# Altium schematic sheet BrauV2_USBSwitch.SchDoc
size 420 x 297 mm; PageSetup: Record=PageOptions|CenterHorizontal=True|CenterVertical=True|PrintScale=1.01|XCorrection=1.00|YCorrection=1.00|PrintKind=1|BorderSize=5000000|LeftOffset=0|BottomOffset=0|Orientation=2|PaperLength=1000|PaperWidth=1000|Scale=100|PaperSource=7|PrintQuality=-4|MediaType=1|DitherType=10|PaperKind=A3|PrintScaleMode=1; DocumentNumber: 15; SheetNumber: 15; SheetTotal: 22
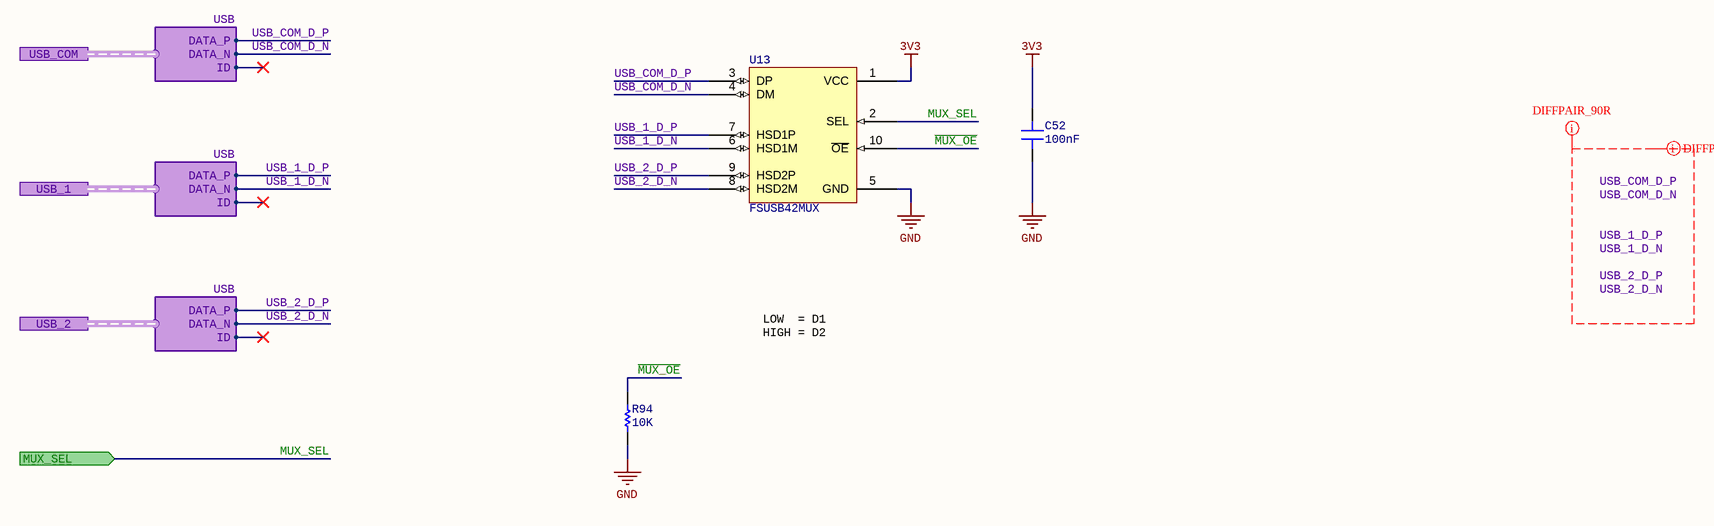
[diagram p0: BrauV2_USBSwitch.SchDoc]

## Parts
C52  Capacitance: 100nF  [SMD_CAP_0402(1005)_N]  (hidden comment: CC0402KRX5R6BB104)
R94  Resistance: 10K  [SMD_RES_0402(1005)_N]  (hidden comment: RC0402FR-0710KL)
U13  FSUSB42MUX  [MSOP-10]

## Ports
MUX_SEL (in), USB_1 (harness USB), USB_2 (harness USB), USB_COM (harness USB)

## Harnesses
USB: DATA_P, DATA_N, ID

## Nets
3V3: C52.2 U13.1(VCC)
GND: C52.1 R94.1 U13.5(GND)
~{MUX_OE}: R94.2 U13.10(~{OE})
MUX_SEL: U13.2(SEL) ; port MUX_SEL
USB_1_D_N: U13.6(HSD1M) ; port USB_1.DATA_N
USB_1_D_P: U13.7(HSD1P) ; port USB_1.DATA_P
USB_2_D_N: U13.8(HSD2M) ; port USB_2.DATA_N
USB_2_D_P: U13.9(HSD2P) ; port USB_2.DATA_P
USB_COM_D_N: U13.4(DM) ; port USB_COM.DATA_N
USB_COM_D_P: U13.3(DP) ; port USB_COM.DATA_P

## Layout directives
differential pair; differential pair class 90R_DIFF_PAIRS; net class 90R_PAIRS: USB_1_D_N, USB_1_D_P, USB_2_D_N, USB_2_D_P, USB_COM_D_N, USB_COM_D_P
mark named DIFFPAIR_90R: USB_1_D_N, USB_1_D_P, USB_2_D_N, USB_2_D_P, USB_COM_D_N, USB_COM_D_P

## Notes on the sheet
- LOW  = D1
  HIGH = D2
- Labels drawn without touching a wire or pin: USB_1_D_N, USB_1_D_P, USB_2_D_N, USB_2_D_P, USB_COM_D_N, USB_COM_D_P
- FILE NAME
- PROJECT
- TITLE
- REV
- AUTHOR
- SIZE
- SHEET
- DATE
- OF
- A3

## Library data of the parts
C52 = 100nF 0402 10V 10%: 100nF ±10% 10V X5R 0402 Multilayer Ceramic Capacitors MLCC - SMD/SMT RoHS; Package: 0402; Tolerance: 10%; Voltage Rating: 10V
R94 = 10K 0402 1% 1/16W: 10kΩ ±1% 1/16W ±100ppm/℃ 0402 Chip Resistor - Surface Mount RoHS; Package: 0402; Tolerance: 1%; Power Rating: 1/16W
U13 = FSUSB42MUX: MSOP-10 USB ICs RoHS